# Altium schematic sheet isolator.SchDoc
size A
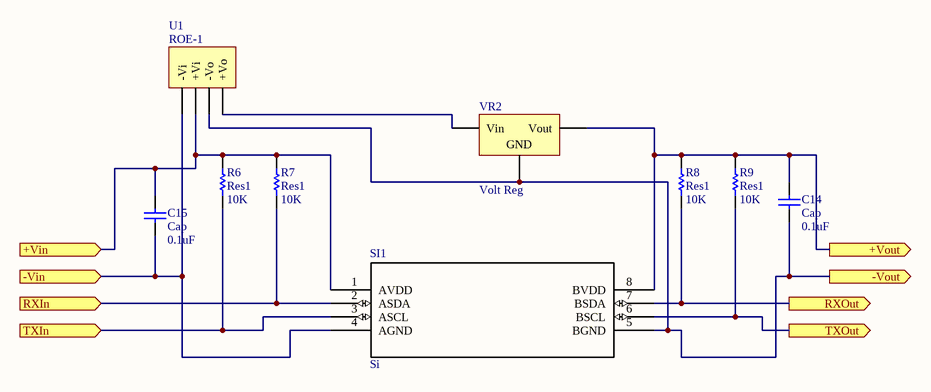
[diagram p0: isolator.SchDoc]

## Parts
C14  Cap  value 0.1uF  [C0805]
C15  Cap  value 0.1uF  [C0805]
R6  Res1  value 10K  [0805R-10K]
R7  Res1  value 10K  [0805R-10K]
R8  Res1  value 10K  [0805R-10K]
R9  Res1  value 10K  [0805R-10K]
ROE-1  U1  [HDR1X4]
SI1  Si  [SOIC-8]
VR2  Volt Reg  [SOT23-123]

## Ports
+Vin (in), +Vout (out), -Vin (in), -Vout (out), RXIn (in), RXOut (out), TXIn (in), TXOut (out)

## Nets
+Vin: C15.2 R6.2 R7.2 ROE-1.2(+Vi) SI1.1(AVDD) ; port +Vin
+Vout: C14.2 R8.2 R9.2 SI1.8(BVDD) VR2.3(Vout) ; port +Vout
-Vin: C15.1 ROE-1.1(-Vi) SI1.4(AGND) ; port -Vin
-Vout: C14.1 ROE-1.3(-Vo) SI1.5(BGND) VR2.2(GND) ; port -Vout
RXIn: R7.1 SI1.2(ASDA) ; port RXIn
RXOut: R8.1 SI1.7(BSDA) ; port RXOut
TXIn: R6.1 SI1.3(ASCL) ; port TXIn
TXOut: R9.1 SI1.6(BSCL) ; port TXOut
NetROE-1_4: ROE-1.4(+Vo) VR2.1(Vin)

## Library data of the parts
C14 C15 = Cap: Capacitor; Published: 8-Jun-2000; LatestRevisionDate: 17-Jul-2002; LatestRevisionNote: Re-released for DXP Platform.; PackageReference: RAD-0.3; Publisher: Altium Limited; PackageDescription: Radial Cap, Thru-Hole; 2 Leads; 0.3 in Pin Spacing
R6-R9 = Res1: Resistor; Published: 8-Jun-2000; LatestRevisionDate: 17-Jul-2002; LatestRevisionNote: Re-released for DXP Platform.; PackageReference: AXIAL-0.3; Publisher: Altium Limited; PackageDescription: Axial Device, Thru-Hole; 2 Leads; 0.3 in Pin Spacing
ROE-1 = Header 4: Header, 4-Pin; LatestRevisionDate: 17-Jul-2002; LatestRevisionNote: Re-released for DXP Platform.; Publisher: Altium Limited
SI1 = Si8600AC-B-IS: Imported; RefDes: RefDes; Type: DEV; Value: Value
VR2 = Volt Reg: Voltage Regulator; pin to pad: 1>3 2>1 3>2; Published: 24-Mar-1999; LatestRevisionDate: 29-May-2009; LatestRevisionNote: IPC-7351 Footprint Added.; PackageReference: D2PAK; Publisher: Altium Limited; PackageDescription: 3-Pin Transistor Outline Package 2.54 mm Pitch, 15.1 mm Lead Span